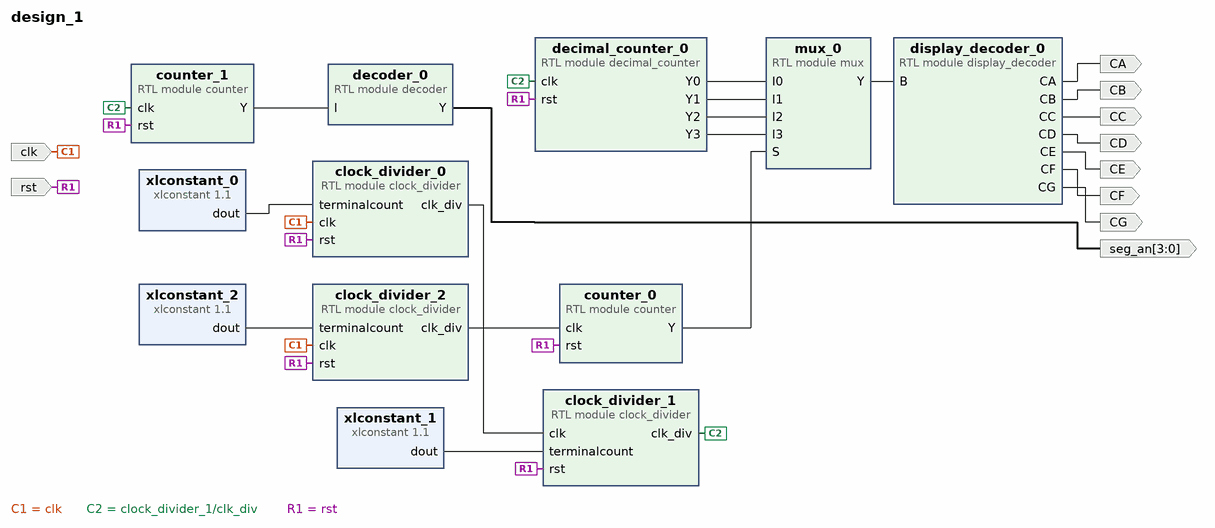
[diagram p0: block diagram of the top level]
# Vivado block design design_1, xc7z007sclg400-1, Vivado 2024.1.1
create_bd_design design_1

create_bd_port -dir O CA
create_bd_port -dir O CB
create_bd_port -dir O CC
create_bd_port -dir O CD
create_bd_port -dir O CE
create_bd_port -dir O CF
create_bd_port -dir O CG
create_bd_port -dir O -from 3 -to 0 seg_an
create_bd_port -dir I clk
create_bd_port -dir I rst

create_bd_cell -type module -reference decimal_counter decimal_counter_0
create_bd_cell -type module -reference mux mux_0
create_bd_cell -type module -reference display_decoder display_decoder_0
create_bd_cell -type module -reference counter counter_0
create_bd_cell -type module -reference counter counter_1
create_bd_cell -type module -reference decoder decoder_0
create_bd_cell -type module -reference clock_divider clock_divider_0
create_bd_cell -type module -reference clock_divider clock_divider_1
create_bd_cell -type ip -vlnv xilinx.com:ip:xlconstant:1.1 xlconstant_0
set_property -dict {CONFIG.CONST_VAL 49999 CONFIG.CONST_WIDTH 17} [get_bd_cells xlconstant_0]
create_bd_cell -type ip -vlnv xilinx.com:ip:xlconstant:1.1 xlconstant_1
set_property -dict {CONFIG.CONST_VAL 499 CONFIG.CONST_WIDTH 17} [get_bd_cells xlconstant_1]
create_bd_cell -type module -reference clock_divider clock_divider_2
create_bd_cell -type ip -vlnv xilinx.com:ip:xlconstant:1.1 xlconstant_2
set_property -dict {CONFIG.CONST_VAL 49999 CONFIG.CONST_WIDTH 17} [get_bd_cells xlconstant_2]

# ---- connections ----

connect_bd_net [get_bd_ports clk] [get_bd_pins clock_divider_0/clk] [get_bd_pins clock_divider_2/clk]
connect_bd_net [get_bd_pins clock_divider_0/clk_div] [get_bd_pins clock_divider_1/clk]
connect_bd_net [get_bd_pins clock_divider_1/clk_div] [get_bd_pins decimal_counter_0/clk] [get_bd_pins counter_1/clk]
connect_bd_net [get_bd_pins clock_divider_2/clk_div] [get_bd_pins counter_0/clk]
connect_bd_net [get_bd_pins counter_0/Y] [get_bd_pins mux_0/S]
connect_bd_net [get_bd_pins counter_1/Y] [get_bd_pins decoder_0/I]
connect_bd_net [get_bd_pins decimal_counter_0/Y0] [get_bd_pins mux_0/I0]
connect_bd_net [get_bd_pins decimal_counter_0/Y1] [get_bd_pins mux_0/I1]
connect_bd_net [get_bd_pins decimal_counter_0/Y2] [get_bd_pins mux_0/I2]
connect_bd_net [get_bd_pins decimal_counter_0/Y3] [get_bd_pins mux_0/I3]
connect_bd_net [get_bd_pins decoder_0/Y] [get_bd_ports seg_an]
connect_bd_net [get_bd_pins display_decoder_0/CA] [get_bd_ports CA]
connect_bd_net [get_bd_pins display_decoder_0/CB] [get_bd_ports CB]
connect_bd_net [get_bd_pins display_decoder_0/CC] [get_bd_ports CC]
connect_bd_net [get_bd_pins display_decoder_0/CD] [get_bd_ports CD]
connect_bd_net [get_bd_pins display_decoder_0/CE] [get_bd_ports CE]
connect_bd_net [get_bd_pins display_decoder_0/CF] [get_bd_ports CF]
connect_bd_net [get_bd_pins display_decoder_0/CG] [get_bd_ports CG]
connect_bd_net [get_bd_pins mux_0/Y] [get_bd_pins display_decoder_0/B]
connect_bd_net [get_bd_ports rst] \
  [get_bd_pins clock_divider_2/rst] [get_bd_pins clock_divider_0/rst] [get_bd_pins clock_divider_1/rst] \
  [get_bd_pins counter_1/rst] [get_bd_pins decimal_counter_0/rst] [get_bd_pins counter_0/rst]
connect_bd_net [get_bd_pins xlconstant_0/dout] [get_bd_pins clock_divider_0/terminalcount]
connect_bd_net [get_bd_pins xlconstant_1/dout] [get_bd_pins clock_divider_1/terminalcount]
connect_bd_net [get_bd_pins xlconstant_2/dout] [get_bd_pins clock_divider_2/terminalcount]

validate_bd_design
save_bd_design
